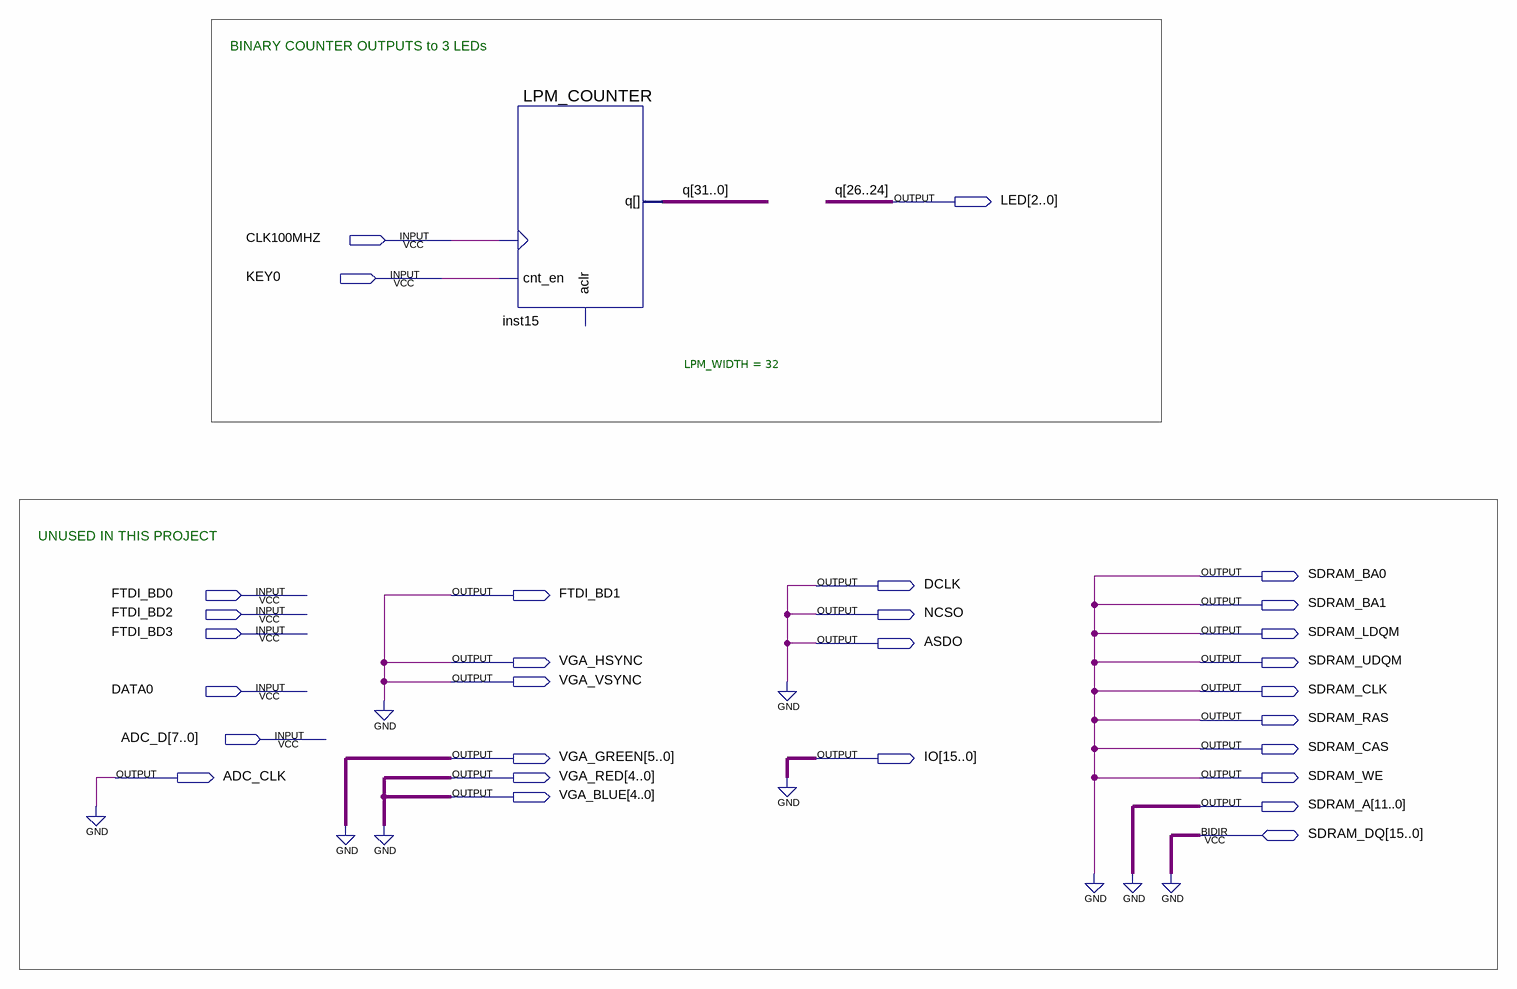
[diagram p0: schematic sheet]
// Quartus schematic m2bis.bdf as structural Verilog: 1 symbols, 29 pins
module m2bis (
  input  CLK100MHZ,
  input  KEY0,
  input  FTDI_BD0,
  input  FTDI_BD2,
  input  FTDI_BD3,
  input  DATA0,
  input  [7:0] ADC_D,
  inout  [15:0] SDRAM_DQ,
  output [2:0] LED,
  output SDRAM_BA0,
  output DCLK,
  output FTDI_BD1,
  output SDRAM_BA1,
  output NCSO,
  output SDRAM_LDQM,
  output ASDO,
  output VGA_HSYNC,
  output SDRAM_UDQM,
  output VGA_VSYNC,
  output SDRAM_CLK,
  output SDRAM_RAS,
  output SDRAM_CAS,
  output [5:0] VGA_GREEN,
  output [15:0] IO,
  output ADC_CLK,
  output [4:0] VGA_RED,
  output SDRAM_WE,
  output [4:0] VGA_BLUE,
  output [11:0] SDRAM_A
);

  wire [31:0] q;

  LPM_COUNTER #(.LPM_WIDTH(32)) inst15 (.clock(CLK100MHZ), .cnt_en(KEY0), .q({q[31:27], LED, q[23:0]}));  // open: aclr

  assign ADC_CLK = 1'b0;
  assign ASDO = 1'b0;
  assign DCLK = 1'b0;
  assign FTDI_BD1 = 1'b0;
  assign IO = {16{1'b0}};
  assign NCSO = 1'b0;
  assign SDRAM_A = {12{1'b0}};
  assign SDRAM_BA0 = 1'b0;
  assign SDRAM_BA1 = 1'b0;
  assign SDRAM_CAS = 1'b0;
  assign SDRAM_CLK = 1'b0;
  assign SDRAM_LDQM = 1'b0;
  assign SDRAM_RAS = 1'b0;
  assign SDRAM_UDQM = 1'b0;
  assign SDRAM_WE = 1'b0;
  assign VGA_BLUE = {5{1'b0}};
  assign VGA_GREEN = {6{1'b0}};
  assign VGA_HSYNC = 1'b0;
  assign VGA_RED = {5{1'b0}};
  assign VGA_VSYNC = 1'b0;
  // also tied to GND on the sheet: {SDRAM_DQ[0], SDRAM_DQ[1], SDRAM_DQ[2], SDRAM_DQ[3], SDRAM_DQ[4], SDRAM_DQ[5], SDRAM_DQ[6], SDRAM_DQ[7], SDRAM_DQ[8], SDRAM_DQ[9], SDRAM_DQ[10], SDRAM_DQ[11], SDRAM_DQ[12], SDRAM_DQ[13], SDRAM_DQ[14], SDRAM_DQ[15]}

  // Other names for the same wires on the sheet: q[26:24] = LED

  // Notes on the sheet:
  //   BINARY COUNTER OUTPUTS to 3 LEDs
  //   UNUSED IN THIS PROJECT
endmodule
